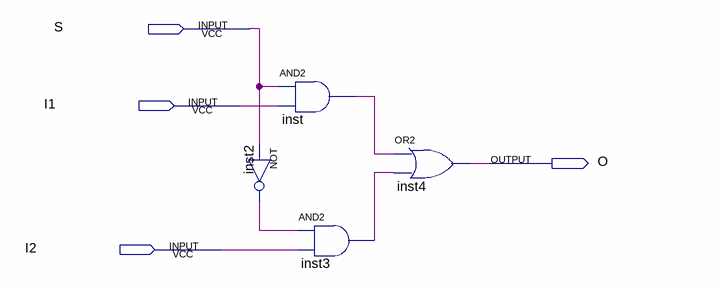
[diagram p0: schematic sheet]
// Quartus schematic bit2_1MUX.bdf as structural Verilog: 4 symbols, 4 pins
module bit2_1MUX (
  input  S,
  input  I1,
  input  I2,
  output O
);

  wire inst2_out, inst3_out, inst_out;

  not inst2 (inst2_out, S);
  and inst (inst_out, S, I1);
  and inst3 (inst3_out, inst2_out, I2);
  or inst4 (O, inst_out, inst3_out);
endmodule
